# Altium schematic sheet FM007.SchDoc: FM007 DW Button CV Led Driver
size A; DrawnBy: Filip Michalski; Engineer: Filip Michalski; Revision: A
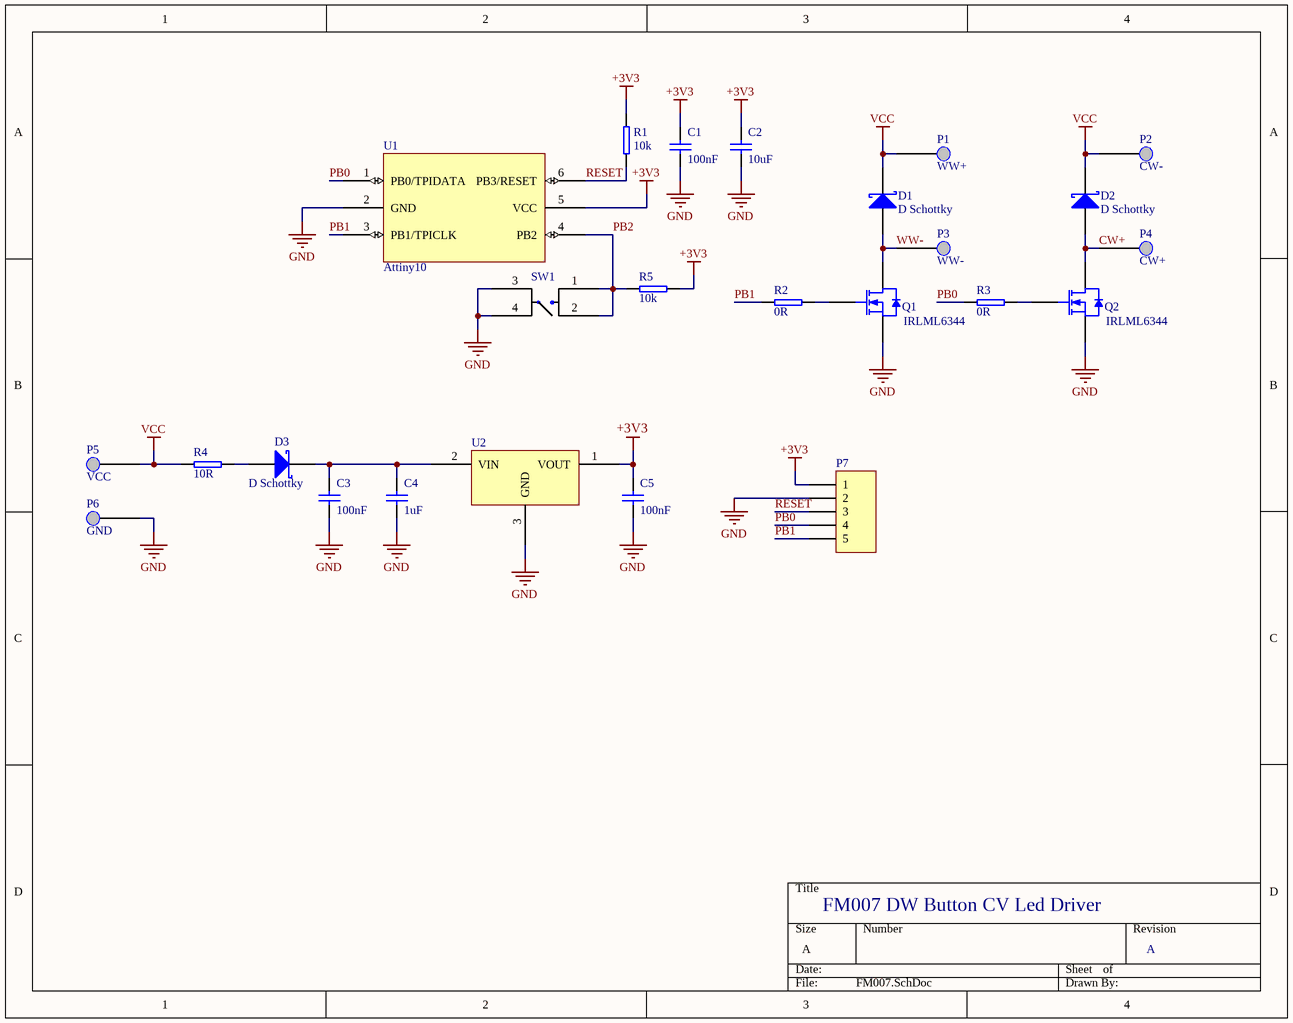
[diagram p0: FM007.SchDoc]

## Parts
C1  100nF  [CAP0603L]
C2  10uF  [CAP0805L]
C3  100nF  [CAP0603L]
C4  1uF  [CAP0805L]
C5  100nF  [CAP0603L]
D1  D Schottky  [SOD-323]
D2  D Schottky  [SOD-323]
D3  D Schottky  [SOD-323]
P1  WW+  [Solder PAD SMD 1530]  (no BOM)
P2  CW-  [Solder PAD SMD 1530]  (no BOM)
P3  WW-  [Solder PAD SMD 1530]  (no BOM)
P4  CW+  [Solder PAD SMD 1530]  (no BOM)
P5  VCC  [Solder PAD SMD 1530]  (no BOM)
P6  GND  [Solder PAD SMD 1530]  (no BOM)
P7  (no value)  [5x1.27mm Header]
Q1  IRLML6344  [SOT23_L]
Q2  IRLML6344  [SOT23_L]
R1  10k  [RES0603L]
R2  0R  [RES0603L]
R3  0R  [RES0603L]
R4  10R  [RES0603L]
R5  10k  [RES0603L]
SW1  (no value)  [Rafi 1.14.100.503/0000]
U1  Attiny10  [SOT95P280X100-6N]
U2  LM3480/TLV760  [SOT23_L]  (value not drawn)

## Nets
+3V3: C1.2 C2.2 C5.2 P7.1 R1.1 R5.2 U1.5(VCC) U2.1(VOUT)
GND: C1.1 C2.1 C3.1 C4.1 C5.1 P6.1 P7.2 Q1.2(S) Q2.2(S) SW1.3 SW1.4 U1.2(GND) U2.3(GND)
VCC: D1.2 D2.2 P1.1 P2.1 P5.1 R4.1
CW+: D2.1 P4.1 Q2.3(D)
PB0: P7.4 R3.1 U1.1(PB0/TPIDATA)
PB1: P7.5 R2.1 U1.3(PB1/TPICLK)
PB2: R5.1 SW1.1 SW1.2 U1.4(PB2)
RESET: P7.3 R1.2 U1.6(PB3/RESET)
WW-: D1.1 P3.1 Q1.3(D)
NetC3_2: C3.2 C4.2 D3.2 U2.2(VIN)
NetD3_1: D3.1 R4.2
NetQ1_1: Q1.1(G) R2.2
NetQ2_1: Q2.1(G) R3.2

## Library data of the parts
C1-C5 = C niebiegunowe: Capacitor (Semiconductor SIM Model); Published: 8-Jun-2000; LatestRevisionDate: 29-May-2009; LatestRevisionNote: IPC-7351 Footprint Added.; PackageReference: C1206; Publisher: Altium Limited; PackageDescription: Chip Capacitor
  C1 C3 C5: Value: 100nF
  C2: Value: 10uF
  C4: Value: 1uF
D1-D3 = D Schottky: Schottky Diode; Published: 8-Jun-2000; LatestRevisionDate: 17-Jul-2002; LatestRevisionNote: Re-released for DXP Platform.; PackageReference: SMB; Publisher: Altium Limited; Code_JEDEC: DO-214-AA
P1-P6 = Solder PAD
  P1: Value: WW+
  P2: Value: CW-
  P3: Value: WW-
  P4: Value: CW+
  P5: Value: VCC
  P6: Value: GND
P7 = Header 5
Q1 Q2 = MOSFET: Value: IRLML6344
R1-R5 = R: Semiconductor Resistor; Published: 8-Jun-2000; LatestRevisionDate: 17-Jul-2002; LatestRevisionNote: Re-released for DXP Platform.; PackageReference: AXIAL-0.5; Publisher: Altium Limited
  R1 R5: Value: 10k
  R2 R3: Value: 0R
  R4: Value: 10R
SW1 = Tact Switch